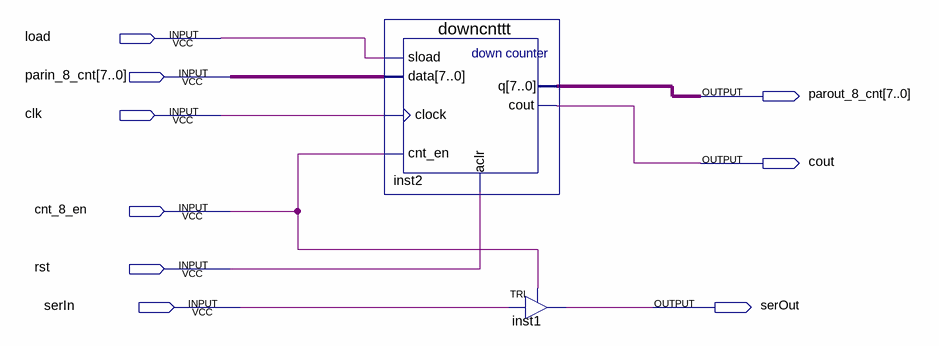
[diagram p0: schematic sheet]
// Quartus schematic bitt_transmittor.bdf as structural Verilog: 2 symbols, 9 pins
module bitt_transmittor (
  input  load,
  input  [7:0] parin_8_cnt,
  input  clk,
  input  cnt_8_en,
  input  rst,
  input  serIn,
  output [7:0] parout_8_cnt,
  output cout,
  output serOut
);

  downcnttt inst2 (
    .sload(load), .data(parin_8_cnt), .clock(clk), .cnt_en(cnt_8_en), .aclr(rst), .cout(cout),
    .q(parout_8_cnt));
  TRI inst1 (.IN(serIn), .OE(cnt_8_en), .OUT(serOut));
endmodule
